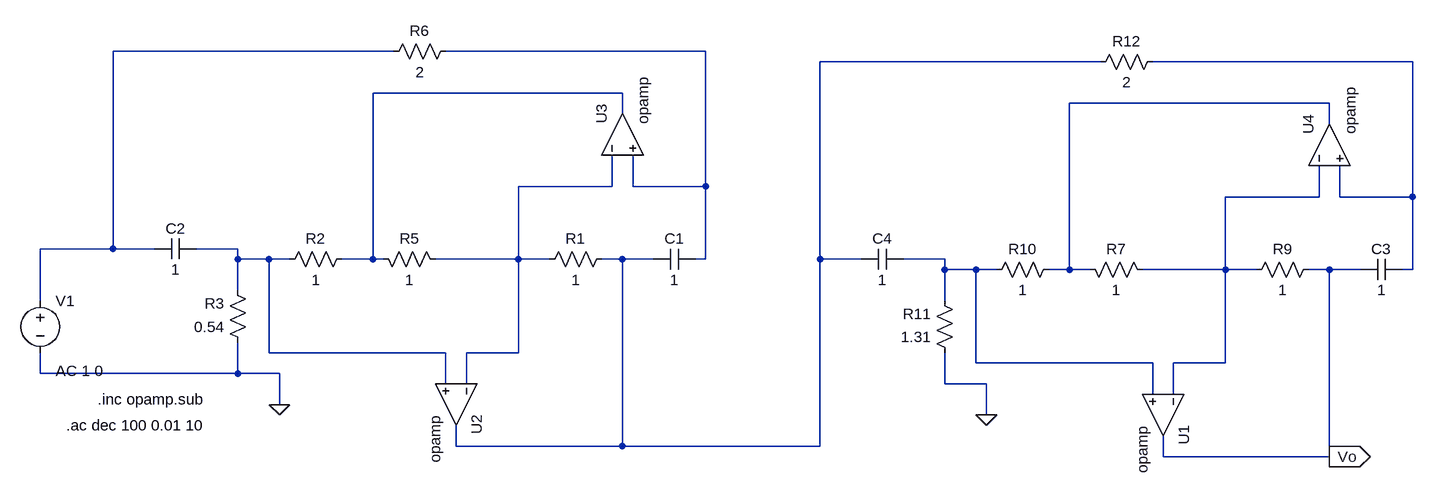
[diagram p0: schematic TS6_gic.asc]
TS6_gic.asc, the LTspice schematic file:
Version 4
SHEET 1 1976 1044
WIRE 400 64 -32 64
WIRE 880 64 480 64
WIRE 1488 80 1056 80
WIRE 1968 80 1568 80
WIRE 752 128 368 128
WIRE 1840 144 1440 144
WIRE 752 160 752 128
WIRE 1840 176 1840 144
WIRE 736 272 736 224
WIRE 736 272 592 272
WIRE 768 272 768 224
WIRE 880 272 880 64
WIRE 880 272 768 272
WIRE 1824 288 1824 240
WIRE 1824 288 1680 288
WIRE 1856 288 1856 240
WIRE 1968 288 1968 80
WIRE 1968 288 1856 288
WIRE -32 368 -32 64
WIRE -32 368 -144 368
WIRE 32 368 -32 368
WIRE 160 368 96 368
WIRE 160 384 160 368
WIRE 208 384 160 384
WIRE 240 384 208 384
WIRE 368 384 368 128
WIRE 368 384 320 384
WIRE 384 384 368 384
WIRE 592 384 592 272
WIRE 592 384 464 384
WIRE 640 384 592 384
WIRE 752 384 720 384
WIRE 800 384 752 384
WIRE 880 384 880 272
WIRE 880 384 864 384
WIRE 1056 384 1056 80
WIRE 1120 384 1056 384
WIRE 1248 384 1184 384
WIRE 1248 400 1248 384
WIRE 1296 400 1248 400
WIRE 1328 400 1296 400
WIRE 1440 400 1440 144
WIRE 1440 400 1408 400
WIRE 1472 400 1440 400
WIRE 1680 400 1680 288
WIRE 1680 400 1552 400
WIRE 1728 400 1680 400
WIRE 1840 400 1808 400
WIRE 1888 400 1840 400
WIRE 1968 400 1968 288
WIRE 1968 400 1952 400
WIRE 160 432 160 384
WIRE -144 448 -144 368
WIRE 1248 448 1248 400
WIRE 208 528 208 384
WIRE 480 528 208 528
WIRE 592 528 592 384
WIRE 592 528 512 528
WIRE 1296 544 1296 400
WIRE 1568 544 1296 544
WIRE 1680 544 1680 400
WIRE 1680 544 1600 544
WIRE -144 560 -144 528
WIRE 160 560 160 512
WIRE 160 560 -144 560
WIRE 224 560 160 560
WIRE 480 576 480 528
WIRE 512 576 512 528
WIRE 1248 576 1248 528
WIRE 1312 576 1248 576
WIRE 1568 592 1568 544
WIRE 1600 592 1600 544
WIRE 224 608 224 560
WIRE 1312 624 1312 576
WIRE 496 672 496 640
WIRE 752 672 752 384
WIRE 752 672 496 672
WIRE 1056 672 1056 384
WIRE 1056 672 752 672
WIRE 1584 688 1584 656
WIRE 1840 688 1840 400
WIRE 1840 688 1584 688
FLAG 224 608 0
FLAG 1312 624 0
FLAG 1840 688 Vo
IOPIN 1840 688 Out
SYMBOL voltage -144 432 R0
WINDOW 123 24 124 Left 2
WINDOW 39 0 0 Left 0
SYMATTR Value2 AC 1 0
SYMATTR InstName V1
SYMATTR Value ""
SYMBOL res 368 368 M90
WINDOW 0 0 56 VBottom 2
WINDOW 3 32 56 VTop 2
SYMATTR InstName R5
SYMATTR Value 1
SYMBOL Opamps/opamp 560 608 R90
SYMATTR InstName U2
SYMBOL Opamps/opamp 688 192 R270
SYMATTR InstName U3
SYMBOL res 624 400 R270
WINDOW 0 32 56 VTop 2
WINDOW 3 0 56 VBottom 2
SYMATTR InstName R1
SYMATTR Value 1
SYMBOL cap 864 368 R90
WINDOW 0 0 32 VBottom 2
WINDOW 3 32 32 VTop 2
SYMATTR InstName C1
SYMATTR Value 1
SYMBOL res 336 368 R90
WINDOW 0 0 56 VBottom 2
WINDOW 3 32 56 VTop 2
SYMATTR InstName R2
SYMATTR Value 1
SYMBOL res 176 528 R180
WINDOW 0 36 76 Left 2
WINDOW 3 36 40 Left 2
SYMATTR InstName R3
SYMATTR Value 0.54
SYMBOL cap 96 352 R90
WINDOW 0 0 32 VBottom 2
WINDOW 3 32 32 VTop 2
SYMATTR InstName C2
SYMATTR Value 1
SYMBOL res 496 48 R90
WINDOW 0 0 56 VBottom 2
WINDOW 3 32 56 VTop 2
SYMATTR InstName R6
SYMATTR Value 2
SYMBOL res 1456 384 M90
WINDOW 0 0 56 VBottom 2
WINDOW 3 32 56 VTop 2
SYMATTR InstName R7
SYMATTR Value 1
SYMBOL Opamps/opamp 1648 624 R90
SYMATTR InstName U1
SYMBOL Opamps/opamp 1776 208 R270
SYMATTR InstName U4
SYMBOL res 1712 416 R270
WINDOW 0 32 56 VTop 2
WINDOW 3 0 56 VBottom 2
SYMATTR InstName R9
SYMATTR Value 1
SYMBOL cap 1952 384 R90
WINDOW 0 0 32 VBottom 2
WINDOW 3 32 32 VTop 2
SYMATTR InstName C3
SYMATTR Value 1
SYMBOL res 1424 384 R90
WINDOW 0 0 56 VBottom 2
WINDOW 3 32 56 VTop 2
SYMATTR InstName R10
SYMATTR Value 1
SYMBOL res 1264 544 R180
WINDOW 0 36 76 Left 2
WINDOW 3 36 40 Left 2
SYMATTR InstName R11
SYMATTR Value 1.31
SYMBOL cap 1184 368 R90
WINDOW 0 0 32 VBottom 2
WINDOW 3 32 32 VTop 2
SYMATTR InstName C4
SYMATTR Value 1
SYMBOL res 1584 64 R90
WINDOW 0 0 56 VBottom 2
WINDOW 3 32 56 VTop 2
SYMATTR InstName R12
SYMATTR Value 2
TEXT -104 640 Left 2 !.ac dec 100 0.01 10
TEXT -56 600 Left 2 !.inc opamp.sub

The netlist it stands for:
* TS6_gic.asc
V1 N001 0 AC 1 0
R5 N005 N007 1
XU2 N007 N009 N003 opamp Aol=100K GBW=10Meg  ; pins invin noninvin out
XU3 N007 N002 N005 opamp Aol=100K GBW=10Meg  ; pins invin noninvin out
R1 N007 N003 1
C1 N002 N003 1
R2 N005 N009 1
R3 0 N009 0.54
C2 N009 N001 1
R6 N002 N001 2
R7 N006 N008 1
XU1 N008 N010 Vo opamp Aol=100K GBW=10Meg  ; pins invin noninvin out
XU4 N008 N004 N006 opamp Aol=100K GBW=10Meg  ; pins invin noninvin out
R9 N008 Vo 1
C3 N004 Vo 1
R10 N006 N010 1
R11 0 N010 1.31
C4 N010 N003 1
R12 N004 N003 2
.ac dec 100 0.01 10
.inc opamp.sub
.backanno
.end